# Altium schematic sheet STeaMi-FP13-Port_Specifique.SchDoc
size A3; DocumentNumber: 1; SheetNumber: 14; SheetTotal: 16
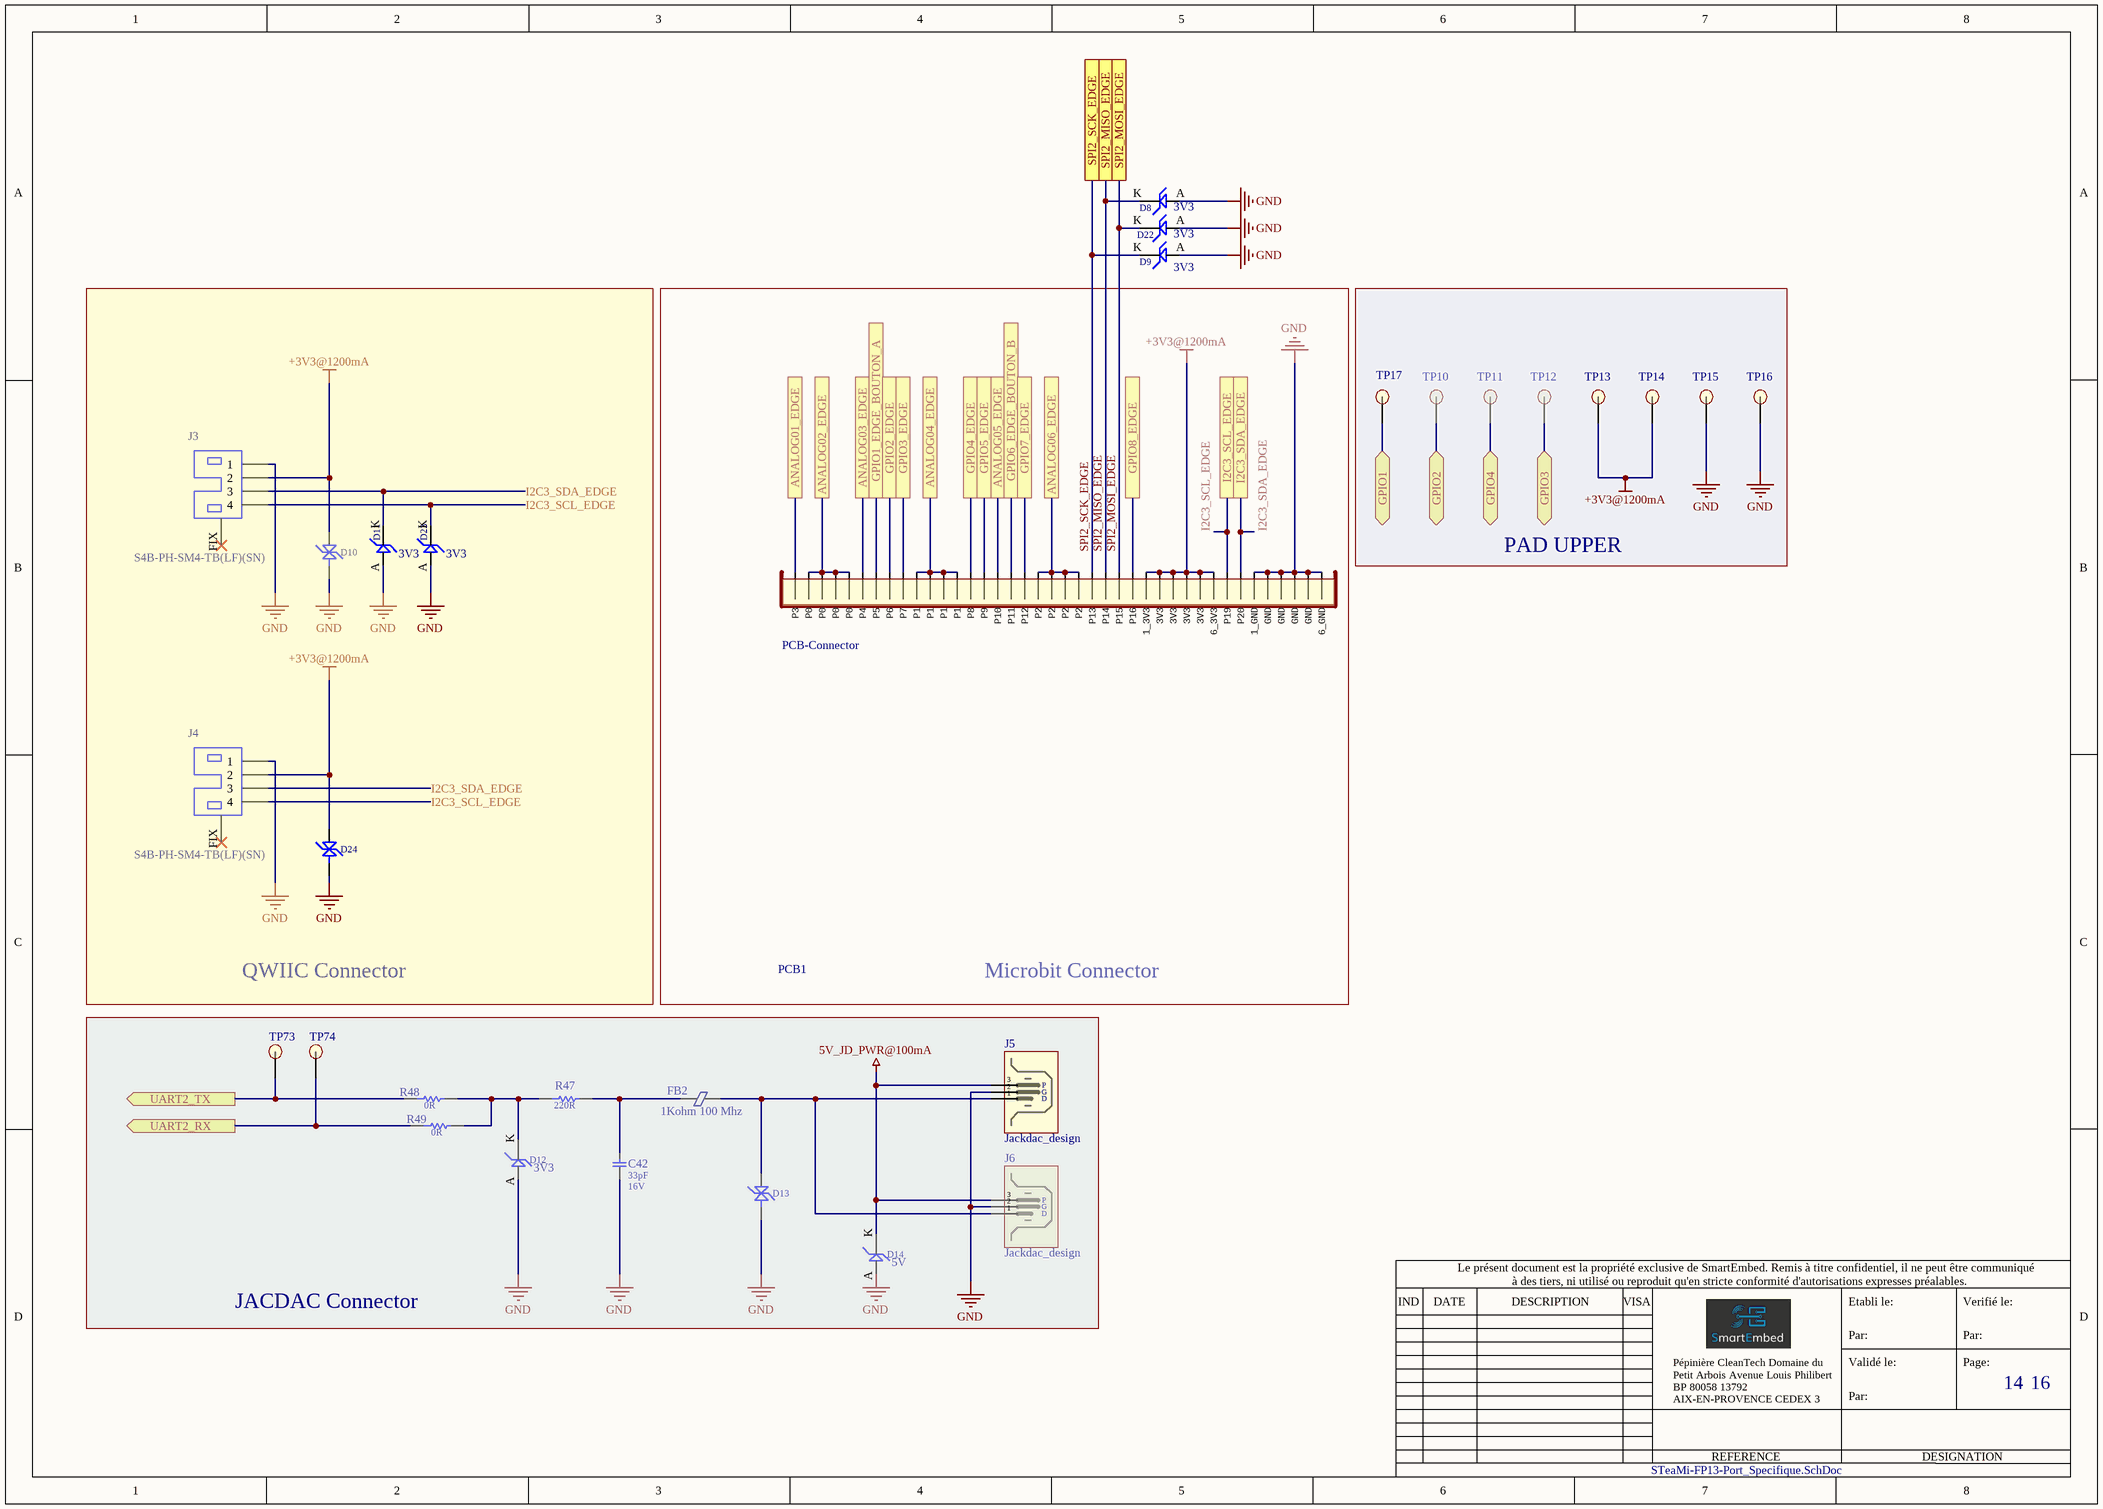
[diagram p0: STeaMi-FP13-Port_Specifique.SchDoc]

## Parts
C42  Capacitance: 33pF  Voltage: 16V  [0402-CAP]
D8  Voltage: 3V3  [SODFL1608X70N]
D9  Voltage: 3V3  [SODFL1608X70N]
D10  (no value)  [DFN100X60X45-2N]
D11  Voltage: 3V3  [SODFL1608X70N]
D12  Voltage: 3V3  [SODFL1608X70N]
D13  (no value)  [DFN100X60X45-2N]
D14  Voltage: 5V  [SODFL1608X70N]
D22  Voltage: 3V3  [SODFL1608X70N]
D23  Voltage: 3V3  [SODFL1608X70N]
D24  (no value)  [DFN100X60X45-2N]
FB2  value 1Kohm 100 Mhz  [BEADC1608X75N]
J3  Part Number: S4B-PH-SM4-TB(LF)(SN)  [JST_S4B-PH-SM4-TB]
J4  Part Number: S4B-PH-SM4-TB(LF)(SN)  [JST_S4B-PH-SM4-TB]
J5  Manufacturer Part Number: Jackdac_design  [JACDAC_FOOTPRINT]  (no BOM)
J6  Manufacturer Part Number: Jackdac_design  [JACDAC_FOOTPRINT]  (no BOM)
PCB1  Manufacturer Part Number: PCB-Connector  [MICROBIT_EDGE]  (no BOM)
R47  Resistance: 220R  [RESC1005X40N_0402]
R48  Resistance: 0R  [RESC1005X40N_0402]
R49  Resistance: 0R  [RESC1005X40N_0402]
TP10  PAD  [Pad_short_aligator]  (value not drawn)  (no BOM)
TP11  PAD  [Pad_short_aligator]  (value not drawn)  (no BOM)
TP12  PAD  [Pad_short_aligator]  (value not drawn)  (no BOM)
TP13  PAD  [Pad_short_aligator]  (value not drawn)  (no BOM)
TP14  PAD  [Pad_short_aligator]  (value not drawn)  (no BOM)
TP15  PAD  [Pad_short_aligator]  (value not drawn)  (no BOM)
TP16  PAD  [Pad_short_aligator]  (value not drawn)  (no BOM)
TP17  PAD  [Pad_short_aligator]  (value not drawn)  (no BOM)
TP73  TX2  [Testpoint 1mm]  (value not drawn)  (no BOM)
TP74  RX2  [Testpoint 1mm]  (value not drawn)  (no BOM)

## Blocks framed on the sheet
QWIIC Connector: D10 D11 D23 D24 J3 J4
Microbit Connector: PCB1
PAD UPPER: TP10-TP17
JACDAC Connector: C42 D12-D14 FB2 J5 J6 R47-R49 TP73 TP74

## Ports
ANALOG01_EDGE, ANALOG02_EDGE, ANALOG03_EDGE, ANALOG04_EDGE, ANALOG05_EDGE, ANALOG06_EDGE, GPIO1 (bidir), GPIO1_EDGE_BOUTON_A, GPIO2 (bidir), GPIO2_EDGE, GPIO3 (bidir), GPIO3_EDGE, GPIO4 (bidir), GPIO4_EDGE, GPIO5_EDGE, GPIO6_EDGE_BOUTON_B, GPIO7_EDGE, GPIO8_EDGE, I2C3_SCL_EDGE, I2C3_SDA_EDGE, SPI2_MISO_EDGE, SPI2_MOSI_EDGE, SPI2_SCK_EDGE, UART2_RX (out), UART2_TX (out)

## Nets
5V_JD_PWR@100mA: D14.K J5.3(JD_PWR) J6.3(JD_PWR)
+3V3@1200mA: D10.1(A) D24.1(A) J3.2 J4.2 PCB1.1_3V3 PCB1.3V3 PCB1.6_3V3 TP13.1 TP14.1
GND: C42.1 D8.A D9.A D10.2(K) D11.A D12.A D13.2(K) D14.A D22.A D23.A D24.2(K) J3.1 J4.1 J5.2(GND) J6.2(GND) PCB1.1_GND PCB1.6_GND PCB1.GND TP15.1 TP16.1
ANALOG01_EDGE: PCB1.P3 ; port ANALOG01_EDGE
ANALOG02_EDGE: PCB1.P0 ; port ANALOG02_EDGE
ANALOG03_EDGE: PCB1.P4 ; port ANALOG03_EDGE
ANALOG04_EDGE: PCB1.P1 ; port ANALOG04_EDGE
ANALOG05_EDGE: PCB1.P10 ; port ANALOG05_EDGE
ANALOG06_EDGE: PCB1.P2 ; port ANALOG06_EDGE
GPIO1: TP17.1 ; port GPIO1
GPIO1_EDGE_BOUTON_A: PCB1.P5 ; port GPIO1_EDGE_BOUTON_A
GPIO2: TP10.1 ; port GPIO2
GPIO2_EDGE: PCB1.P6 ; port GPIO2_EDGE
GPIO3: TP12.1 ; port GPIO3
GPIO3_EDGE: PCB1.P7 ; port GPIO3_EDGE
GPIO4: TP11.1 ; port GPIO4
GPIO4_EDGE: PCB1.P8 ; port GPIO4_EDGE
GPIO5_EDGE: PCB1.P9 ; port GPIO5_EDGE
GPIO6_EDGE_BOUTON_B: PCB1.P11 ; port GPIO6_EDGE_BOUTON_B
GPIO7_EDGE: PCB1.P12 ; port GPIO7_EDGE
GPIO8_EDGE: PCB1.P16 ; port GPIO8_EDGE
I2C3_SCL_EDGE: D23.K J3.4 J4.4 PCB1.P19 ; port I2C3_SCL_EDGE
I2C3_SDA_EDGE: D11.K J3.3 J4.3 PCB1.P20 ; port I2C3_SDA_EDGE
SPI2_MISO_EDGE: D8.K PCB1.P14 ; port SPI2_MISO_EDGE
SPI2_MOSI_EDGE: D22.K PCB1.P15 ; port SPI2_MOSI_EDGE
SPI2_SCK_EDGE: D9.K PCB1.P13 ; port SPI2_SCK_EDGE
UART2_RX: R49.1 TP74.1 ; port UART2_RX
UART2_TX: R48.1 TP73.1 ; port UART2_TX
NetC42_2: C42.2 FB2.1 R47.2
NetD12_K: D12.K R47.1 R48.2 R49.2
NetD13_1: D13.1(A) FB2.2 J5.1(JD_DATA) J6.1(JD_DATA)

Not connected (* = marked no-connect by the designer): J3 FIX*; J4 FIX*

## Notes on the sheet
- Le présent document est la propriété exclusive de SmartEmbed. Remis à titre confidentiel, il ne peut être communiqué
- IND
- DATE
- DESCRIPTION
- VISA
- à des tiers, ni utilisé ou reproduit qu'en stricte conformité d'autorisations expresses préalables.
- Etabli le:
- Verifié le:
- Validé le:
- Par:
- Page:
- /
- Pépinière CleanTech Domaine du Petit Arbois Avenue Louis Philibert BP 80058 13792 AIX-EN-PROVENCE CEDEX 3
- REFERENCE
- DESIGNATION
- (in symbol JACDAC_PCB) P; G; D

## Library data of the parts
C42 = 33pF-5%-16V-COG-0402: CAP CER 33pF 16V COG 0402; Manufacturer: WURTH Electronics; Manufacturer Part Number: 885012005028; Populated: True; std Package: 0402; Tolerence: 0,05; Vérification: Non; Created by: EAG; Creation Date: 02/12/2021; Checked by: *; Part Number: 33pF-5%-16V-COG-0402; Dielectric: COG; Digikey: 732-7444-1-ND; Mouser: 710-885012005028; Switch possibility: True
D8 D9 D11 D12 D14 D22 D23 = ESD8351XV2T1G: Suppresseurs ESD / diodes TVS LOW CAP SNAPBACK ESD PROT; Manufacturer: OnSemiconductor; Populated: True; Switch possibility: False; Vérification: Non; Created by: EAG; Creation Date: 18/12/2021; Manufacturer Part Number: ESD8351XV2T1G; Part Number: ESD8351XV2T1G; Farnell: 2770609; Mouser: 863-ESD8351XV2T1G
D10 D13 D24 = D5V0H1B2LP-7B: ESD Suppressors / TVS Diodes Transient Voltage Suppressor PP; Manufacturer: Diodes Incorporated; Populated: True; Switch possibility: False; Voltage: 5,5V; Vérification: Non; Created by: EAG; Creation Date: 01/10/2021; Manufacturer Part Number: D5V0H1B2LP-7B; ComponentLink1Description: Datasheet; ComponentLink1URL: https://m.littelfuse.com/~/media/electronics/product_specifications/polymer_esd_suppressors/littelfuse_polymer_esd_suppressor_pesd0402_140_product_specification.pdf.pdf; Part Number: D5V0H1B2LP-7B; Digikey: D5V0H1B2LP-7BDICT-ND; Mouser: 621-D5V0H1B2LP-7B
FB2 = BLM18RK102SN1D: Chip Ferrite Bead 330 ohm à 100MHZ; Manufacturer: MURATA; Populated: True; Switch possibility: False; Vérification: Non; Created by: EAG; Creation Date: 28/07/2020; Manufacturer Part Number: BLM18RK102SN1D; Checked by: *; Part Number: BLM18RK102SN1D; Mouser: 81-BLM18RK102SN1D
J3 J4 = S4B-PH-SM4-TB(LF)(SN): Connecteur, embase Montage en surface à angle droit 4 positions (2,00mm); Manufacturer: JST; Populated: True; Switch possibility: False; Vérification: Non; Created by: EAG; Creation Date: 20/09/2021; Manufacturer Part Number: S4B-PH-SM4-TB(LF)(SN); Digikey: 455-1751-1-ND; Farnell: 9492631
J5 J6 = JACDAC_PCB: PCB connector Jackdac; Manufacturer: Microsoft; Populated: False; Switch possibility: False; Vérification: Non; Checked by: *; Creation Date: 01/09/2021; Created by: EAG; Part Number: JACDAC_PCB
PCB1 = PCBMICROBIT: Design PCB connector P0-P16, 3V3,GND; Populated: False; Switch possibility: False; Vérification: Non; Created by: EAG; Creation Date: 20/09/2021; Manufacturer: MicroBit; Checked by: *; Ambient Temperature: ='Ambient temp'; Storage temperature: ='Storage temp'; AEC: ='AEC'; Current: *; RoHs compliant: ='Rohs'; Datasheet: ='Datasheet'; Part Number: PCBMICROBIT
R47 = 220R-5%-0,1W-0402: RES CMS 220R5%-0,1W-0402 ±10ppm/°C; Manufacturer: Panasonic; Manufacturer Part Number: ERJ-2GEJ221X; Populated: True; Power: 0,1; Nom vérificateur: Non; Prix: 0,085; std Package: 0402; Tolerence: 5%; Created by: EAG; Creation Date: 31/01/2021; Part Number: 220R-5%-0,1W-0402; Digikey: P220JCT-ND; Farnell: 2692419; Mouser: 667-ERJ-2GEJ221X; Switch possibility: True
R48 R49 = 0R-5%-0,0625W-0402: RES CMS 0R5%-0,0625W-0402; Manufacturer: Yageo; Manufacturer Part Number: RC0402JR-100RL; Populated: True; Power: 0,0625; Nom vérificateur: Non; Prix: 0,09; std Package: 0402; Tolerence: 0,05; Created by: EAG; Creation Date: 02/12/2021; Part Number: 0R-5%-0,0625W-0402; Mouser: 603-RC0402JR-100RL; Switch possibility: True
TP10-TP17 = Pad_short_aligator: Manufacturer: Smartembed; Manufacturer Part Number: ALIGATOR_TEST; Switch possibility: False; Vérification: Non; Package: PAD_TEST; Part Number: Pad_short_aligator; Created by: EAG; Creation Date: 20/09/2021; Digikey: -; Farnell: -; Mouser: -; RS: -
TP73 TP74 = TESTPOINTPAD: Manufacturer: SmartEmbed; Package: PAD_TEST; Part Number: TESTPOINTPAD